# Altium schematic sheet motherboard_conectors.SchDoc
size 594 x 420 mm; SheetNumber: 4; SheetTotal: 5
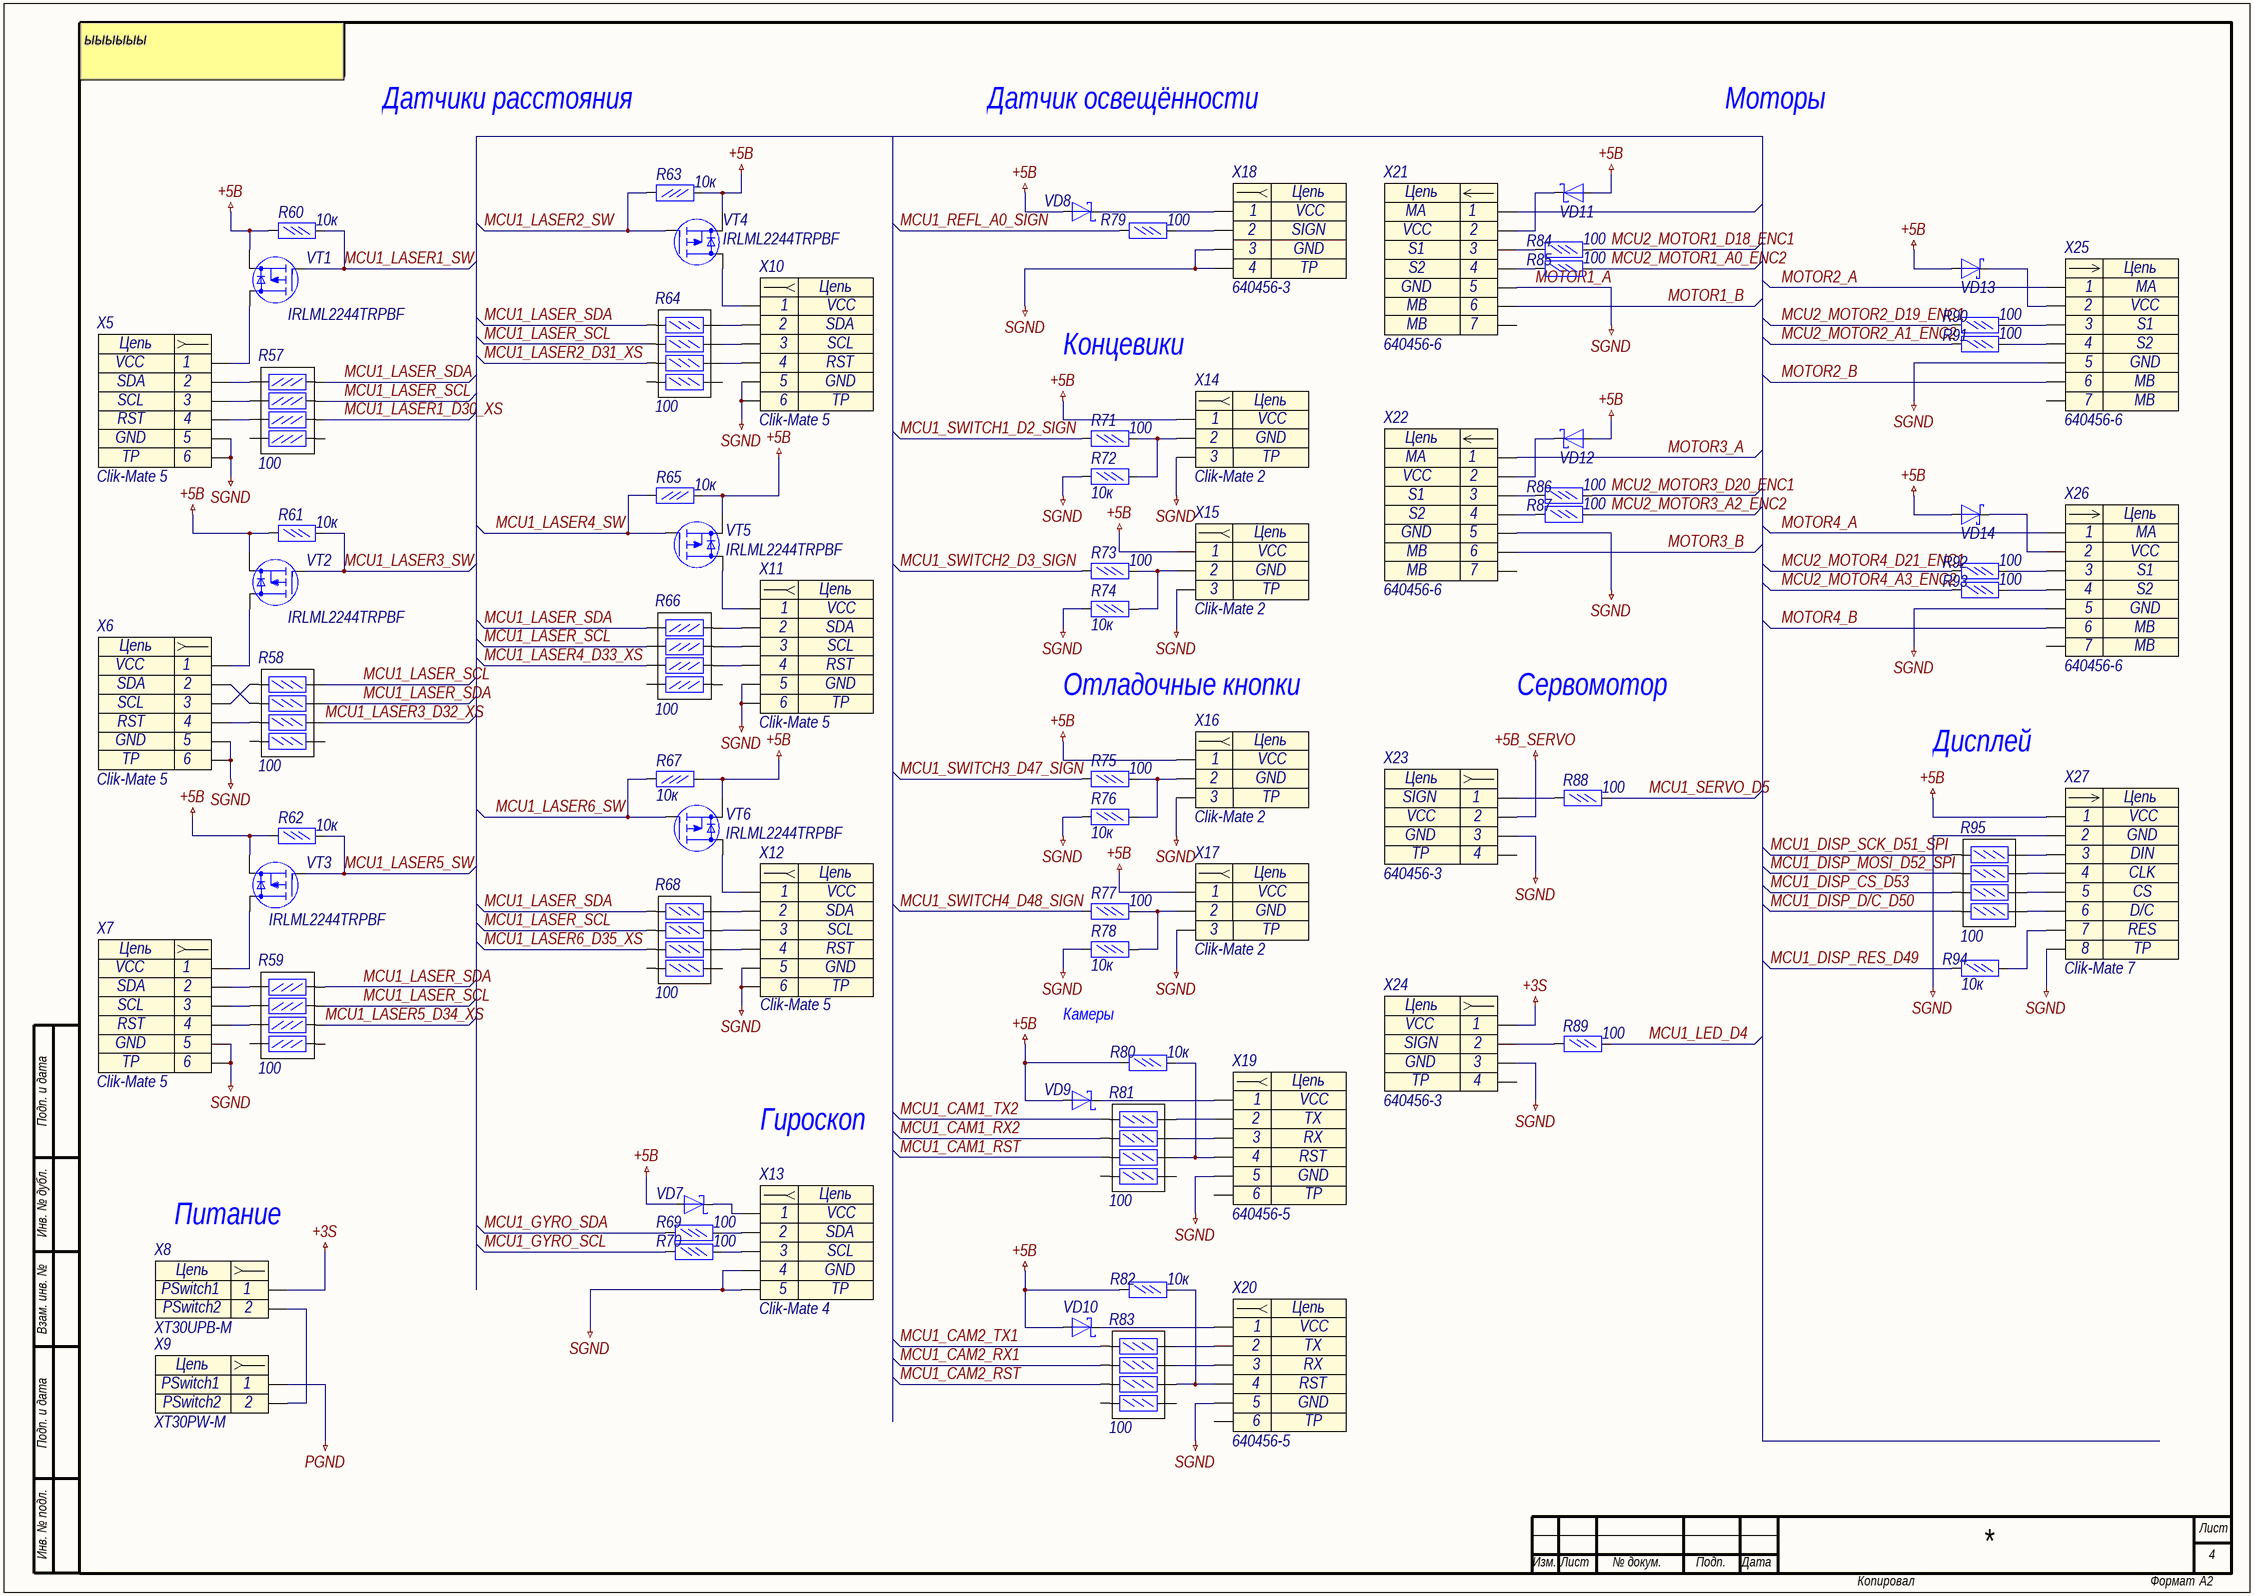
[diagram p0: motherboard_conectors.SchDoc]

## Parts
R57  100  [R0603X4]
R58  100  [R0603X4]
R59  100  [R0603X4]
R60  10к  [R0603]
R61  10к  [R0603]
R62  10к  [R0603]
R63  10к  [R0603]
R64  100  [R0603X4]
R65  10к  [R0603]
R66  100  [R0603X4]
R67  10к  [R0603]
R68  100  [R0603X4]
R69  100  [R0603]
R70  100  [R0603]
R71  100  [R0603]
R72  10к  [R0603]
R73  100  [R0603]
R74  10к  [R0603]
R75  100  [R0603]
R76  10к  [R0603]
R77  100  [R0603]
R78  10к  [R0603]
R79  100  [R0603]
R80  10к  [R0603]
R81  100  [R0603X4]
R82  10к  [R0603]
R83  100  [R0603X4]
R84  100  [R0603]
R85  100  [R0603]
R86  100  [R0603]
R87  100  [R0603]
R88  100  [R0603]
R89  100  [R0603]
R90  100  [R0603]
R91  100  [R0603]
R92  100  [R0603]
R93  100  [R0603]
R94  10к  [R0603]
R95  100  [R0603X4]
VD7  (no value)  [SOD123_A]
VD8  (no value)  [SOD123_A]
VD9  (no value)  [SOD123_A]
VD10  (no value)  [SOD123_A]
VD11  (no value)  [SOD123_A]
VD12  (no value)  [SOD123_A]
VD13  (no value)  [SOD123_A]
VD14  (no value)  [SOD123_A]
VT1  IRLML2244TRPBF  [SOT23]
VT2  IRLML2244TRPBF  [SOT23]
VT3  IRLML2244TRPBF  [SOT23]
VT4  IRLML2244TRPBF  [SOT23]
VT5  IRLML2244TRPBF  [SOT23]
VT6  IRLML2244TRPBF  [SOT23]
X5  Clik-Mate 5  [Clik-Mate 5]
X6  Clik-Mate 5  [Clik-Mate 5]
X7  Clik-Mate 5  [Clik-Mate 5]
X8  XT30UPB-M  [XT30UPB-M]
X9  XT30PW-M  [XT30PW-M]
X10  Clik-Mate 5  [Clik-Mate 5]
X11  Clik-Mate 5  [Clik-Mate 5]
X12  Clik-Mate 5  [Clik-Mate 5]
X13  Clik-Mate 4  [Clik-Mate 4]
X14  Clik-Mate 2  [Clik-Mate 2]
X15  Clik-Mate 2  [Clik-Mate 2]
X16  Clik-Mate 2  [Clik-Mate 2]
X17  Clik-Mate 2  [Clik-Mate 2]
X18  640456-3  [Clik-Mate 3]
X19  640456-5  [JST-640456-5]
X20  640456-5  [JST-640456-5]
X21  640456-6  [JST-640456-6]
X22  640456-6  [JST-640456-6]
X23  640456-3  [JST-640456-3]
X24  640456-3  [JST-640456-3]
X25  640456-6  [JST-640456-6]
X26  640456-6  [JST-640456-6]
X27  Clik-Mate 7  [Clik-Mate 7]

## Nets
+3S: X8.1 X24.1
+5В: R60.1 R61.1 R62.1 R63.1 R65.1 R67.1 R80.1 R82.1 VD7.2(A) VD8.2(A) VD9.2(A) VD10.2(A) VD11.2(A) VD12.2(A) VD13.2(A) VD14.2(A) VT1.2(S) VT2.2(S) VT3.2(S) VT4.2(S) VT5.2(S) VT6.2(S) X14.1 X15.1 X16.1 X17.1 X27.1
+5В_SERVO: X23.2
MOTOR1_A: R72.1 R74.1 R76.1 R78.1 X5.0 X5.5 X6.0 X6.5 X7.0 X7.5 X10.0 X10.5 X11.0 X11.5 X12.0 X12.5 X13.0 X13.4 X14.0 X15.0 X16.0 X17.0 X18.0 X18.3 X19.5 X20.5 X21.5 X22.5 X23.3 X24.3 X25.5 X26.5 X27.0 X27.2  [also labelled SGND]
PGND: X9.1
MCU1_CAM1_RST: R81.5
MCU1_CAM1_RX2: R81.3
MCU1_CAM1_TX2: R81.1
MCU1_CAM2_RST: R83.5
MCU1_CAM2_RX1: R83.3
MCU1_CAM2_TX1: R83.1
MCU1_DISP_CS_D53: R95.5
MCU1_DISP_D/C_D50: R95.7
MCU1_DISP_MOSI_D52_SPI: R95.3
MCU1_DISP_RES_D49: R94.1
MCU1_DISP_SCK_D51_SPI: R95.1
MCU1_GYRO_SCL: R70.1
MCU1_GYRO_SDA: R69.1
MCU1_LASER1_D30_XS: R57.5
MCU1_LASER1_SW: R60.2 VT1.1(G)
MCU1_LASER2_D31_XS: R64.5
MCU1_LASER2_SW: R63.2 VT4.1(G)
MCU1_LASER3_D32_XS: R58.6
MCU1_LASER3_SW: R61.2 VT2.1(G)
MCU1_LASER4_D33_XS: R66.6
MCU1_LASER4_SW: R65.2 VT5.1(G)
MCU1_LASER5_D34_XS: R59.5
MCU1_LASER5_SW: R62.2 VT3.1(G)
MCU1_LASER6_D35_XS: R68.5
MCU1_LASER6_SW: R67.2 VT6.1(G)
MCU1_LASER_SCL: R57.3 R58.2 R59.3 R64.3 R66.4 R68.3
MCU1_LASER_SDA: R57.1 R58.4 R59.1 R64.1 R66.2 R68.1
MCU1_LED_D4: R89.2
MCU1_REFL_A0_SIGN: R79.1
MCU1_SERVO_D5: R88.2
MCU1_SWITCH1_D2_SIGN: R71.1
MCU1_SWITCH2_D3_SIGN: R73.1
MCU1_SWITCH3_D47_SIGN: R75.1
MCU1_SWITCH4_D48_SIGN: R77.1
MCU2_MOTOR1_A0_ENC2: R85.2
MCU2_MOTOR1_D18_ENC1: R84.2
MCU2_MOTOR2_A1_ENC2: R91.1
MCU2_MOTOR2_D19_ENC1: R90.1
MCU2_MOTOR3_A2_ENC2: R87.2
MCU2_MOTOR3_D20_ENC1: R86.2
MCU2_MOTOR4_A3_ENC2: R93.1
MCU2_MOTOR4_D21_ENC1: R92.1
MOTOR1_B: X21.6
MOTOR2_A: X25.1
MOTOR2_B: X25.6
MOTOR3_A: X22.1
MOTOR3_B: X22.6
MOTOR4_A: X26.1
MOTOR4_B: X26.6
NetR57_2: R57.2 X5.2
NetR57_4: R57.4 X5.3
NetR57_6: R57.6 X5.4
NetR58_1: R58.1 X6.3
NetR58_3: R58.3 X6.2
NetR58_5: R58.5 X6.4
NetR59_2: R59.2 X7.2
NetR59_4: R59.4 X7.3
NetR59_6: R59.6 X7.4
NetR64_2: R64.2 X10.2
NetR64_4: R64.4 X10.3
NetR64_6: R64.6 X10.4
NetR66_1: R66.1 X11.2
NetR66_3: R66.3 X11.3
NetR66_5: R66.5 X11.4
NetR68_2: R68.2 X12.2
NetR68_4: R68.4 X12.3
NetR68_6: R68.6 X12.4
NetR69_2: R69.2 X13.2
NetR70_2: R70.2 X13.3
NetR71_2: R71.2 R72.2 X14.2
NetR73_2: R73.2 R74.2 X15.2
NetR75_2: R75.2 R76.2 X16.2
NetR77_2: R77.2 R78.2 X17.2
NetR79_2: R79.2 X18.2
NetR80_2: R80.2 R81.6 X19.4
NetR81_2: R81.2 X19.2
NetR81_4: R81.4 X19.3
NetR82_2: R82.2 R83.6 X20.4
NetR83_2: R83.2 X20.2
NetR83_4: R83.4 X20.3
NetR84_1: R84.1 X21.3
NetR85_1: R85.1 X21.4
NetR86_1: R86.1 X22.3
NetR87_1: R87.1 X22.4
NetR88_1: R88.1 X23.1
NetR89_1: R89.1 X24.2
NetR90_2: R90.2 X25.3
NetR91_2: R91.2 X25.4
NetR92_2: R92.2 X26.3
NetR93_2: R93.2 X26.4
NetR94_2: R94.2 X27.7
NetR95_2: R95.2 X27.3
NetR95_4: R95.4 X27.4
NetR95_6: R95.6 X27.5
NetR95_8: R95.8 X27.6
NetVD7_1: VD7.1(K) X13.1
NetVD8_1: VD8.1(K) X18.1
NetVD9_1: VD9.1(K) X19.1
NetVD10_1: VD10.1(K) X20.1
NetVD11_1: VD11.1(K) X21.2
NetVD12_1: VD12.1(K) X22.2
NetVD13_1: VD13.1(K) X25.2
NetVD14_1: VD14.1(K) X26.2
NetVT1_3: VT1.3(D) X5.1
NetVT2_3: VT2.3(D) X6.1
NetVT3_3: VT3.3(D) X7.1
NetVT4_3: VT4.3(D) X10.1
NetVT5_3: VT5.3(D) X11.1
NetVT6_3: VT6.3(D) X12.1
NetX8_2: X8.2 X9.2

Not connected (* = marked no-connect by the designer): R57 7 8; R58 7 8; R59 7 8; R64 7 8; R66 7 8; R68 7 8; R81 7 8; R83 7 8; X19 0; X20 0; X21 0 1; X22 0; X23 0; X24 0; X25 0; X26 0

## Notes on the sheet
- ыыыыыы
- Датчики расстояния
- Датчик освещённости
- Моторы
- Концевики
- Отладочные кнопки
- Сервомотор
- Дисплей
- Камеры
- Гироскоп
- Питание
- Подп. и дата
- Инв. № дубл.
- Взам. инв. №
- Инв. № подл.
- Лист
- Изм.
- № докум.
- Подп.
- Дата
- Копировал
- Формат
- А2
- (in symbol Header_2) Цепь; 3
- (in symbol Header_3) Цепь; 4
- (in symbol Header_4) Цепь; 5
- (in symbol Header_5) Цепь; 6
- (in symbol Header_6) Цепь; 7
- (in symbol Header_7) Цепь; 8
- (in symbol XT30PW-M) Цепь
- (in symbol XT30UPB-M) Цепь

## Library data of the parts
R57-R59 R64 R66 R68 R81 R83 R95 = Резисторная сборка 0.05 x 4: Value: 100
R60-R62 R69 R70 R80 R82 = Резистор 0.05Вт: Резистор 0,05Вт
  R60-R62 R80 R82: Value: 10к
  R69 R70: Value: 100
R63 R65 R67 R71-R79 R84-R94 = Резистор  0,05Вт: Резистор 0,05Вт
  R63 R65 R67 R72 R74 R76 R78 R94: Value: 10к
  R71 R73 R75 R77 R79 R84-R93: Value: 100
VD7-VD14 = DiodeSchottky: Диод Шоттки
VT1-VT6 = транзистор n-канал: Name: IRLML2244TRPBF
X5-X7 X10-X12 = Header_5: Разъем - 5 конт. мама; Contact_1: VCC; Contact_2: SDA; Contact_3: SCL; Contact_4: RST; Contact_5: GND; Contact_6: TP; Name: Clik-Mate 5
X8 = XT30UPB-M: Contact_1: PSwitch1; Contact_2: PSwitch2; Name: XT30UPB-M
X9 = XT30PW-M: Contact_1: PSwitch1; Contact_2: PSwitch2; Name: XT30PW-M
X13 = Header_4: Разъем - 4 конт. мама; Contact_1: VCC; Contact_2: SDA; Contact_3: SCL; Contact_4: GND; Contact_5: TP; Name: Clik-Mate 4
X14-X17 = Header_2: Разъем - 3 конт. розетка; Contact_1: VCC; Contact_2: GND; Contact_3: TP; Name: Clik-Mate 2
X18 X24 = Header_3: Разъем - 3 конт. розетка; Contact_1: VCC; Contact_2: SIGN; Contact_3: GND; Contact_4: TP; Name: 640456-3
X19 X20 = Header_5: Разъем - 5 конт. мама; Contact_1: VCC; Contact_2: TX; Contact_3: RX; Contact_4: RST; Contact_5: GND; Contact_6: TP; Name: 640456-5
X21 X22 X25 X26 = Header_6: Разъем - 6 конт. мама; Contact_1: MA; Contact_2: VCC; Contact_3: S1; Contact_4: S2; Contact_5: GND; Contact_6: MB; Contact_7: TP; Name: 640456-6
X23 = Header_3: Разъем - 3 конт. розетка; Contact_1: SIGN; Contact_2: VCC; Contact_3: GND; Contact_4: TP; Name: 640456-3
X27 = Header_7: Разъем - 7 конт. мама; Contact_1: VCC; Contact_2: GND; Contact_3: DIN; Contact_4: CLK; Contact_5: CS; Contact_6: D/C; Contact_7: RES; Contact_8: TP; Name: Clik-Mate 7